# Altium project HVProject.PrjPCB
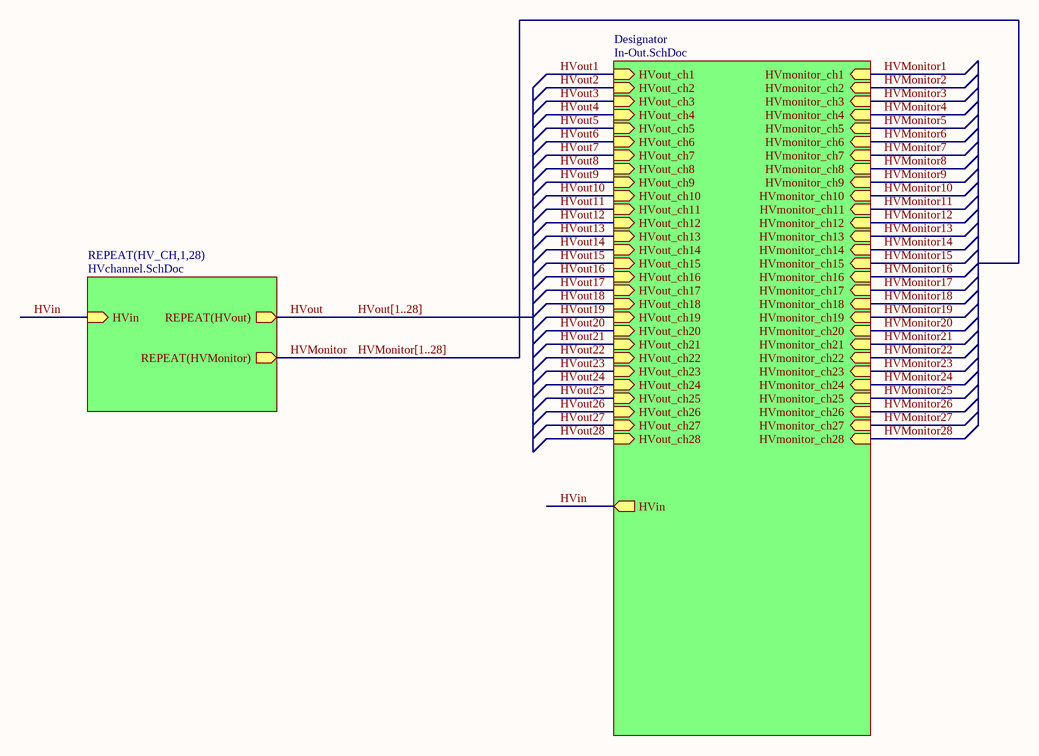
[diagram p0: Main.SchDoc]
3 sheets, 260 parts. Net scope: hierarchical (ports join the sheet entries above them; power ports are global).
Board file: HV.PcbDoc
Sheets:
  Main.SchDoc
    Designator = In-Out.SchDoc
    HV_CH1 = HVchannel.SchDoc
    HV_CH2 = HVchannel.SchDoc
    HV_CH3 = HVchannel.SchDoc
    HV_CH4 = HVchannel.SchDoc
    HV_CH5 = HVchannel.SchDoc
    HV_CH6 = HVchannel.SchDoc
    HV_CH7 = HVchannel.SchDoc
    HV_CH8 = HVchannel.SchDoc
    HV_CH9 = HVchannel.SchDoc
    HV_CH10 = HVchannel.SchDoc
    HV_CH11 = HVchannel.SchDoc
    HV_CH12 = HVchannel.SchDoc
    HV_CH13 = HVchannel.SchDoc
    HV_CH14 = HVchannel.SchDoc
    HV_CH15 = HVchannel.SchDoc
    HV_CH16 = HVchannel.SchDoc
    HV_CH17 = HVchannel.SchDoc
    HV_CH18 = HVchannel.SchDoc
    HV_CH19 = HVchannel.SchDoc
    HV_CH20 = HVchannel.SchDoc
    HV_CH21 = HVchannel.SchDoc
    HV_CH22 = HVchannel.SchDoc
    HV_CH23 = HVchannel.SchDoc
    HV_CH24 = HVchannel.SchDoc
    HV_CH25 = HVchannel.SchDoc
    HV_CH26 = HVchannel.SchDoc
    HV_CH27 = HVchannel.SchDoc
    HV_CH28 = HVchannel.SchDoc

## Sheet Main.SchDoc
size A4

### Sub-sheets
Designator = In-Out.SchDoc: HVout_ch1 (in), HVout_ch2 (in), HVout_ch3 (in), HVout_ch4 (in), HVout_ch5 (in), HVout_ch6 (in), HVout_ch7 (in), HVout_ch8 (in), HVout_ch9 (in), HVout_ch10 (in), HVout_ch11 (in), HVout_ch12 (in), HVout_ch13 (in), HVout_ch14 (in), HVout_ch15 (in), HVout_ch16 (in), HVout_ch17 (in), HVout_ch18 (in), HVout_ch19 (in), HVout_ch20 (in), HVout_ch21 (in), HVout_ch22 (in), HVout_ch23 (in), HVout_ch24 (in), HVout_ch25 (in), HVout_ch26 (in), HVout_ch27 (in), HVout_ch28 (in), HVmonitor_ch1 (in), HVmonitor_ch2 (in), HVmonitor_ch3 (in), HVmonitor_ch4 (in), HVmonitor_ch5 (in), HVmonitor_ch6 (in), HVmonitor_ch7 (in), HVmonitor_ch8 (in), HVmonitor_ch9 (in), HVmonitor_ch10 (in), HVmonitor_ch11 (in), HVmonitor_ch12 (in), HVmonitor_ch13 (in), HVmonitor_ch14 (in), HVmonitor_ch15 (in), HVmonitor_ch16 (in), HVmonitor_ch17 (in), HVmonitor_ch18 (in), HVmonitor_ch19 (in), HVmonitor_ch20 (in), HVmonitor_ch21 (in), HVmonitor_ch22 (in), HVmonitor_ch23 (in), HVmonitor_ch24 (in), HVmonitor_ch25 (in), HVmonitor_ch26 (in), HVmonitor_ch27 (in), HVmonitor_ch28 (in), HVin (out)
REPEAT(HV_CH,1,28) = HVchannel.SchDoc: HVin (in), REPEAT(HVout) (out), REPEAT(HVMonitor) (out)

### Nets
HVin: sheet Designator/HVin, sheet REPEAT(HV_CH,1,28)/HVin
HVMonitor: sheet REPEAT(HV_CH,1,28)/REPEAT(HVMonitor)
HVout: sheet REPEAT(HV_CH,1,28)/REPEAT(HVout)

### Buses and harness runs
bus HVMonitor[1..28]
bus HVout[1..28]

## Sheet In-Out.SchDoc
size A4
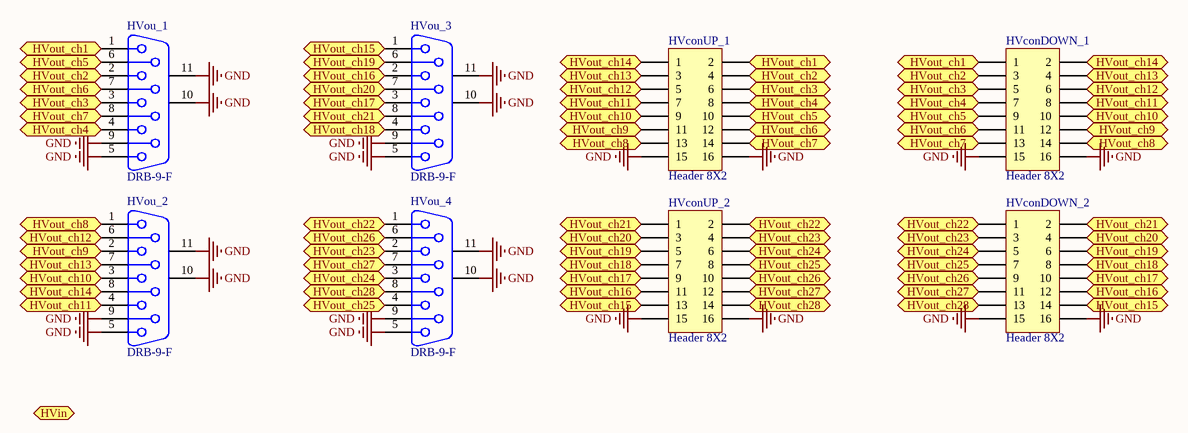
[diagram p1: In-Out.SchDoc]

### Parts
HVconDOWN_1  Header 8X2  [HDR2X8]
HVconDOWN_2  Header 8X2  [HDR2X8]
HVconUP_1  Header 8X2  [HDR2X8]
HVconUP_2  Header 8X2  [HDR2X8]
HVou_1  DRB-9-F  [DSUB1.385-2H9]
HVou_2  DRB-9-F  [DSUB1.385-2H9]
HVou_3  DRB-9-F  [DSUB1.385-2H9]
HVou_4  DRB-9-F  [DSUB1.385-2H9]

### Ports
HVin (out), HVout_ch1 (out), HVout_ch2 (out), HVout_ch3 (out), HVout_ch4 (out), HVout_ch5 (out), HVout_ch6 (out), HVout_ch7 (out), HVout_ch8 (out), HVout_ch9 (out), HVout_ch10 (out), HVout_ch11 (out), HVout_ch12 (out), HVout_ch13 (out), HVout_ch14 (out), HVout_ch15 (out), HVout_ch16 (out), HVout_ch17 (out), HVout_ch18 (out), HVout_ch19 (out), HVout_ch20 (out), HVout_ch21 (out), HVout_ch22 (out), HVout_ch23 (out), HVout_ch24 (out), HVout_ch25 (out), HVout_ch26 (out), HVout_ch27 (out), HVout_ch28 (out)

### Nets
GND: HVconDOWN_1.15 HVconDOWN_1.16 HVconDOWN_2.15 HVconDOWN_2.16 HVconUP_1.15 HVconUP_1.16 HVconUP_2.15 HVconUP_2.16 HVou_1.5 HVou_1.9 HVou_1.10(MH1) HVou_1.11(MH2) HVou_2.5 HVou_2.9 HVou_2.10(MH1) HVou_2.11(MH2) HVou_3.5 HVou_3.9 HVou_3.10(MH1) HVou_3.11(MH2) HVou_4.5 HVou_4.9 HVou_4.10(MH1) HVou_4.11(MH2)
HVout1: HVconDOWN_1.1 HVconUP_1.2 HVou_1.1 ; port HVout_ch1
HVout2: HVconDOWN_1.3 HVconUP_1.4 HVou_1.2 ; port HVout_ch2
HVout3: HVconDOWN_1.5 HVconUP_1.6 HVou_1.3 ; port HVout_ch3
HVout4: HVconDOWN_1.7 HVconUP_1.8 HVou_1.4 ; port HVout_ch4
HVout5: HVconDOWN_1.9 HVconUP_1.10 HVou_1.6 ; port HVout_ch5
HVout6: HVconDOWN_1.11 HVconUP_1.12 HVou_1.7 ; port HVout_ch6
HVout7: HVconDOWN_1.13 HVconUP_1.14 HVou_1.8 ; port HVout_ch7
HVout8: HVconDOWN_1.14 HVconUP_1.13 HVou_2.1 ; port HVout_ch8
HVout9: HVconDOWN_1.12 HVconUP_1.11 HVou_2.2 ; port HVout_ch9
HVout10: HVconDOWN_1.10 HVconUP_1.9 HVou_2.3 ; port HVout_ch10
HVout11: HVconDOWN_1.8 HVconUP_1.7 HVou_2.4 ; port HVout_ch11
HVout12: HVconDOWN_1.6 HVconUP_1.5 HVou_2.6 ; port HVout_ch12
HVout13: HVconDOWN_1.4 HVconUP_1.3 HVou_2.7 ; port HVout_ch13
HVout14: HVconDOWN_1.2 HVconUP_1.1 HVou_2.8 ; port HVout_ch14
HVout15: HVconDOWN_2.14 HVconUP_2.13 HVou_3.1 ; port HVout_ch15
HVout16: HVconDOWN_2.12 HVconUP_2.11 HVou_3.2 ; port HVout_ch16
HVout17: HVconDOWN_2.10 HVconUP_2.9 HVou_3.3 ; port HVout_ch17
HVout18: HVconDOWN_2.8 HVconUP_2.7 HVou_3.4 ; port HVout_ch18
HVout19: HVconDOWN_2.6 HVconUP_2.5 HVou_3.6 ; port HVout_ch19
HVout20: HVconDOWN_2.4 HVconUP_2.3 HVou_3.7 ; port HVout_ch20
HVout21: HVconDOWN_2.2 HVconUP_2.1 HVou_3.8 ; port HVout_ch21
HVout22: HVconDOWN_2.1 HVconUP_2.2 HVou_4.1 ; port HVout_ch22
HVout23: HVconDOWN_2.3 HVconUP_2.4 HVou_4.2 ; port HVout_ch23
HVout24: HVconDOWN_2.5 HVconUP_2.6 HVou_4.3 ; port HVout_ch24
HVout25: HVconDOWN_2.7 HVconUP_2.8 HVou_4.4 ; port HVout_ch25
HVout26: HVconDOWN_2.9 HVconUP_2.10 HVou_4.6 ; port HVout_ch26
HVout27: HVconDOWN_2.11 HVconUP_2.12 HVou_4.7 ; port HVout_ch27
HVout28: HVconDOWN_2.13 HVconUP_2.14 HVou_4.8 ; port HVout_ch28

### Library data of the parts
HVconDOWN_1 HVconDOWN_2 HVconUP_1 HVconUP_2 = Header 8X2: Header, 8-Pin, Dual row; LatestRevisionDate: 17-Jul-2002; LatestRevisionNote: Re-released for DXP Platform.; Publisher: Altium Limited
HVou_1-HVou_4 = D Connector 9: Receptacle Assembly, 9 Position, Right Angle; PackageDocument: O; Positions: 9; Published: 15-Jun-2001; LatestRevisionDate: 17-Jul-2002; LatestRevisionNote: Re-released for DXP Platform.; DatasheetDocument: 1-Sep-1999; PackageReference: 788750; Publisher: Altium Limited; Orientation: Right Angle; Gender: Receptacle

## Sheet HVchannel.SchDoc
size A4; Author: Epshteyn L.; DrawnBy: Epshteyn L.
Used 28 times, as channels HV_CH1, HV_CH2, HV_CH3, HV_CH4, HV_CH5, HV_CH6, HV_CH7, HV_CH8, HV_CH9, HV_CH10, HV_CH11, HV_CH12, HV_CH13, HV_CH14, HV_CH15, HV_CH16, HV_CH17, HV_CH18, HV_CH19, HV_CH20, HV_CH21, HV_CH22, HV_CH23, HV_CH24, HV_CH25, HV_CH26, HV_CH27, HV_CH28. Parts and nets are listed once, with the designators drawn on the sheet.
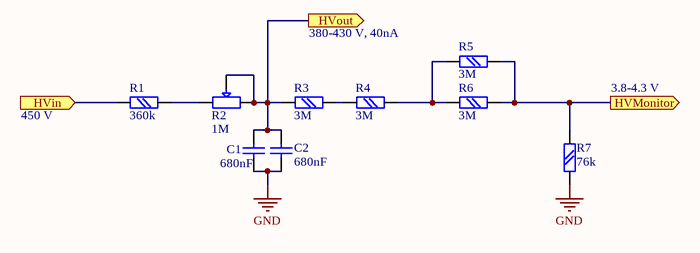
[diagram p2: HVchannel.SchDoc]

### Parts
C1  680nF  [C20P0_4]
C2  680nF  [C20P0_4]
R1  360k  [chip0805]
R2  1M  [SH-R114S]
R3  3M  [chip0805]
R4  3M  [chip0805]
R5  3M  [chip0805]
R6  3M  [chip0805]
R7  76k  [chip0805]

### Ports
HVin (in), HVMonitor (out), HVout (out)

### Nets
GND: C1.1 C2.1 R7.2
HVin: R1.1 ; port HVin
HVMonitor: R5.2 R6.2 R7.1 ; port HVMonitor
HVout: C1.2 C2.2 R2.2 R2.3 R3.1 ; port HVout
NetR1_2: R1.2 R2.1
NetR3_2: R3.2 R4.1
NetR4_2: R4.2 R5.1 R6.1

### Channels
HV_CH1: designators end in _HV_CH1; ports HVin=HVin HVMonitor=HVMonitor1 HVout=HVout1
HV_CH2: designators end in _HV_CH2; ports HVin=HVin HVMonitor=HVMonitor2 HVout=HVout2
HV_CH3: designators end in _HV_CH3; ports HVin=HVin HVMonitor=HVMonitor3 HVout=HVout3
HV_CH4: designators end in _HV_CH4; ports HVin=HVin HVMonitor=HVMonitor4 HVout=HVout4
HV_CH5: designators end in _HV_CH5; ports HVin=HVin HVMonitor=HVMonitor5 HVout=HVout5
HV_CH6: designators end in _HV_CH6; ports HVin=HVin HVMonitor=HVMonitor6 HVout=HVout6
HV_CH7: designators end in _HV_CH7; ports HVin=HVin HVMonitor=HVMonitor7 HVout=HVout7
HV_CH8: designators end in _HV_CH8; ports HVin=HVin HVMonitor=HVMonitor8 HVout=HVout8
HV_CH9: designators end in _HV_CH9; ports HVin=HVin HVMonitor=HVMonitor9 HVout=HVout9
HV_CH10: designators end in _HV_CH10; ports HVin=HVin HVMonitor=HVMonitor10 HVout=HVout10
HV_CH11: designators end in _HV_CH11; ports HVin=HVin HVMonitor=HVMonitor11 HVout=HVout11
HV_CH12: designators end in _HV_CH12; ports HVin=HVin HVMonitor=HVMonitor12 HVout=HVout12
HV_CH13: designators end in _HV_CH13; ports HVin=HVin HVMonitor=HVMonitor13 HVout=HVout13
HV_CH14: designators end in _HV_CH14; ports HVin=HVin HVMonitor=HVMonitor14 HVout=HVout14
HV_CH15: designators end in _HV_CH15; ports HVin=HVin HVMonitor=HVMonitor15 HVout=HVout15
HV_CH16: designators end in _HV_CH16; ports HVin=HVin HVMonitor=HVMonitor16 HVout=HVout16
HV_CH17: designators end in _HV_CH17; ports HVin=HVin HVMonitor=HVMonitor17 HVout=HVout17
HV_CH18: designators end in _HV_CH18; ports HVin=HVin HVMonitor=HVMonitor18 HVout=HVout18
HV_CH19: designators end in _HV_CH19; ports HVin=HVin HVMonitor=HVMonitor19 HVout=HVout19
HV_CH20: designators end in _HV_CH20; ports HVin=HVin HVMonitor=HVMonitor20 HVout=HVout20
HV_CH21: designators end in _HV_CH21; ports HVin=HVin HVMonitor=HVMonitor21 HVout=HVout21
HV_CH22: designators end in _HV_CH22; ports HVin=HVin HVMonitor=HVMonitor22 HVout=HVout22
HV_CH23: designators end in _HV_CH23; ports HVin=HVin HVMonitor=HVMonitor23 HVout=HVout23
HV_CH24: designators end in _HV_CH24; ports HVin=HVin HVMonitor=HVMonitor24 HVout=HVout24
HV_CH25: designators end in _HV_CH25; ports HVin=HVin HVMonitor=HVMonitor25 HVout=HVout25
HV_CH26: designators end in _HV_CH26; ports HVin=HVin HVMonitor=HVMonitor26 HVout=HVout26
HV_CH27: designators end in _HV_CH27; ports HVin=HVin HVMonitor=HVMonitor27 HVout=HVout27
HV_CH28: designators end in _HV_CH28; ports HVin=HVin HVMonitor=HVMonitor28 HVout=HVout28

### Notes on the sheet
- 380-430 V, 40nA
- 450 V
- 3.8-4.3 V

### Library data of the parts
C1 C2 = Cap: Capacitor; Published: 8-Jun-2000; LatestRevisionDate: 17-Jul-2002; LatestRevisionNote: Re-released for DXP Platform.; PackageReference: RAD-0.3; Publisher: Altium Limited
R1 R3-R7 = R: Text Field1: 20; Text Field2: 20
R2 = R VAR: Text Field1: 20; Text Field2: 20

## Nets that join several sheets
GND: In-Out (24 pins), HV_CH1 (C1_HV_CH1.1 C2_HV_CH1.1 R7_HV_CH1.2), HV_CH2 (C1_HV_CH2.1 C2_HV_CH2.1 R7_HV_CH2.2), HV_CH3 (C1_HV_CH3.1 C2_HV_CH3.1 R7_HV_CH3.2), HV_CH4 (C1_HV_CH4.1 C2_HV_CH4.1 R7_HV_CH4.2), HV_CH5 (C1_HV_CH5.1 C2_HV_CH5.1 R7_HV_CH5.2), HV_CH6 (C1_HV_CH6.1 C2_HV_CH6.1 R7_HV_CH6.2), HV_CH7 (C1_HV_CH7.1 C2_HV_CH7.1 R7_HV_CH7.2), HV_CH8 (C1_HV_CH8.1 C2_HV_CH8.1 R7_HV_CH8.2), HV_CH9 (C1_HV_CH9.1 C2_HV_CH9.1 R7_HV_CH9.2), HV_CH10 (C1_HV_CH10.1 C2_HV_CH10.1 R7_HV_CH10.2), HV_CH11 (C1_HV_CH11.1 C2_HV_CH11.1 R7_HV_CH11.2), HV_CH12 (C1_HV_CH12.1 C2_HV_CH12.1 R7_HV_CH12.2), HV_CH13 (C1_HV_CH13.1 C2_HV_CH13.1 R7_HV_CH13.2), HV_CH14 (C1_HV_CH14.1 C2_HV_CH14.1 R7_HV_CH14.2), HV_CH15 (C1_HV_CH15.1 C2_HV_CH15.1 R7_HV_CH15.2), HV_CH16 (C1_HV_CH16.1 C2_HV_CH16.1 R7_HV_CH16.2), HV_CH17 (C1_HV_CH17.1 C2_HV_CH17.1 R7_HV_CH17.2), HV_CH18 (C1_HV_CH18.1 C2_HV_CH18.1 R7_HV_CH18.2), HV_CH19 (C1_HV_CH19.1 C2_HV_CH19.1 R7_HV_CH19.2), HV_CH20 (C1_HV_CH20.1 C2_HV_CH20.1 R7_HV_CH20.2), HV_CH21 (C1_HV_CH21.1 C2_HV_CH21.1 R7_HV_CH21.2), HV_CH22 (C1_HV_CH22.1 C2_HV_CH22.1 R7_HV_CH22.2), HV_CH23 (C1_HV_CH23.1 C2_HV_CH23.1 R7_HV_CH23.2), HV_CH24 (C1_HV_CH24.1 C2_HV_CH24.1 R7_HV_CH24.2), HV_CH25 (C1_HV_CH25.1 C2_HV_CH25.1 R7_HV_CH25.2), HV_CH26 (C1_HV_CH26.1 C2_HV_CH26.1 R7_HV_CH26.2), HV_CH27 (C1_HV_CH27.1 C2_HV_CH27.1 R7_HV_CH27.2), HV_CH28 (C1_HV_CH28.1 C2_HV_CH28.1 R7_HV_CH28.2)
HVin: HV_CH1 (R1_HV_CH1.1), HV_CH2 (R1_HV_CH2.1), HV_CH3 (R1_HV_CH3.1), HV_CH4 (R1_HV_CH4.1), HV_CH5 (R1_HV_CH5.1), HV_CH6 (R1_HV_CH6.1), HV_CH7 (R1_HV_CH7.1), HV_CH8 (R1_HV_CH8.1), HV_CH9 (R1_HV_CH9.1), HV_CH10 (R1_HV_CH10.1), HV_CH11 (R1_HV_CH11.1), HV_CH12 (R1_HV_CH12.1), HV_CH13 (R1_HV_CH13.1), HV_CH14 (R1_HV_CH14.1), HV_CH15 (R1_HV_CH15.1), HV_CH16 (R1_HV_CH16.1), HV_CH17 (R1_HV_CH17.1), HV_CH18 (R1_HV_CH18.1), HV_CH19 (R1_HV_CH19.1), HV_CH20 (R1_HV_CH20.1), HV_CH21 (R1_HV_CH21.1), HV_CH22 (R1_HV_CH22.1), HV_CH23 (R1_HV_CH23.1), HV_CH24 (R1_HV_CH24.1), HV_CH25 (R1_HV_CH25.1), HV_CH26 (R1_HV_CH26.1), HV_CH27 (R1_HV_CH27.1), HV_CH28 (R1_HV_CH28.1)
HVout1: In-Out (HVconDOWN_1.1 HVconUP_1.2 HVou_1.1), HV_CH1 (5 pins)
HVout2: In-Out (HVconDOWN_1.3 HVconUP_1.4 HVou_1.2), HV_CH2 (5 pins)
HVout3: In-Out (HVconDOWN_1.5 HVconUP_1.6 HVou_1.3), HV_CH3 (5 pins)
HVout4: In-Out (HVconDOWN_1.7 HVconUP_1.8 HVou_1.4), HV_CH4 (5 pins)
HVout5: In-Out (HVconDOWN_1.9 HVconUP_1.10 HVou_1.6), HV_CH5 (5 pins)
HVout6: In-Out (HVconDOWN_1.11 HVconUP_1.12 HVou_1.7), HV_CH6 (5 pins)
HVout7: In-Out (HVconDOWN_1.13 HVconUP_1.14 HVou_1.8), HV_CH7 (5 pins)
HVout8: In-Out (HVconDOWN_1.14 HVconUP_1.13 HVou_2.1), HV_CH8 (5 pins)
HVout9: In-Out (HVconDOWN_1.12 HVconUP_1.11 HVou_2.2), HV_CH9 (5 pins)
HVout10: In-Out (HVconDOWN_1.10 HVconUP_1.9 HVou_2.3), HV_CH10 (5 pins)
HVout11: In-Out (HVconDOWN_1.8 HVconUP_1.7 HVou_2.4), HV_CH11 (5 pins)
HVout12: In-Out (HVconDOWN_1.6 HVconUP_1.5 HVou_2.6), HV_CH12 (5 pins)
HVout13: In-Out (HVconDOWN_1.4 HVconUP_1.3 HVou_2.7), HV_CH13 (5 pins)
HVout14: In-Out (HVconDOWN_1.2 HVconUP_1.1 HVou_2.8), HV_CH14 (5 pins)
HVout15: In-Out (HVconDOWN_2.14 HVconUP_2.13 HVou_3.1), HV_CH15 (5 pins)
HVout16: In-Out (HVconDOWN_2.12 HVconUP_2.11 HVou_3.2), HV_CH16 (5 pins)
HVout17: In-Out (HVconDOWN_2.10 HVconUP_2.9 HVou_3.3), HV_CH17 (5 pins)
HVout18: In-Out (HVconDOWN_2.8 HVconUP_2.7 HVou_3.4), HV_CH18 (5 pins)
HVout19: In-Out (HVconDOWN_2.6 HVconUP_2.5 HVou_3.6), HV_CH19 (5 pins)
HVout20: In-Out (HVconDOWN_2.4 HVconUP_2.3 HVou_3.7), HV_CH20 (5 pins)
HVout21: In-Out (HVconDOWN_2.2 HVconUP_2.1 HVou_3.8), HV_CH21 (5 pins)
HVout22: In-Out (HVconDOWN_2.1 HVconUP_2.2 HVou_4.1), HV_CH22 (5 pins)
HVout23: In-Out (HVconDOWN_2.3 HVconUP_2.4 HVou_4.2), HV_CH23 (5 pins)
HVout24: In-Out (HVconDOWN_2.5 HVconUP_2.6 HVou_4.3), HV_CH24 (5 pins)
HVout25: In-Out (HVconDOWN_2.7 HVconUP_2.8 HVou_4.4), HV_CH25 (5 pins)
HVout26: In-Out (HVconDOWN_2.9 HVconUP_2.10 HVou_4.6), HV_CH26 (5 pins)
HVout27: In-Out (HVconDOWN_2.11 HVconUP_2.12 HVou_4.7), HV_CH27 (5 pins)
HVout28: In-Out (HVconDOWN_2.13 HVconUP_2.14 HVou_4.8), HV_CH28 (5 pins)